# Altium schematic sheet HV_BUCK_V2.SchDoc (part 2 of 3)
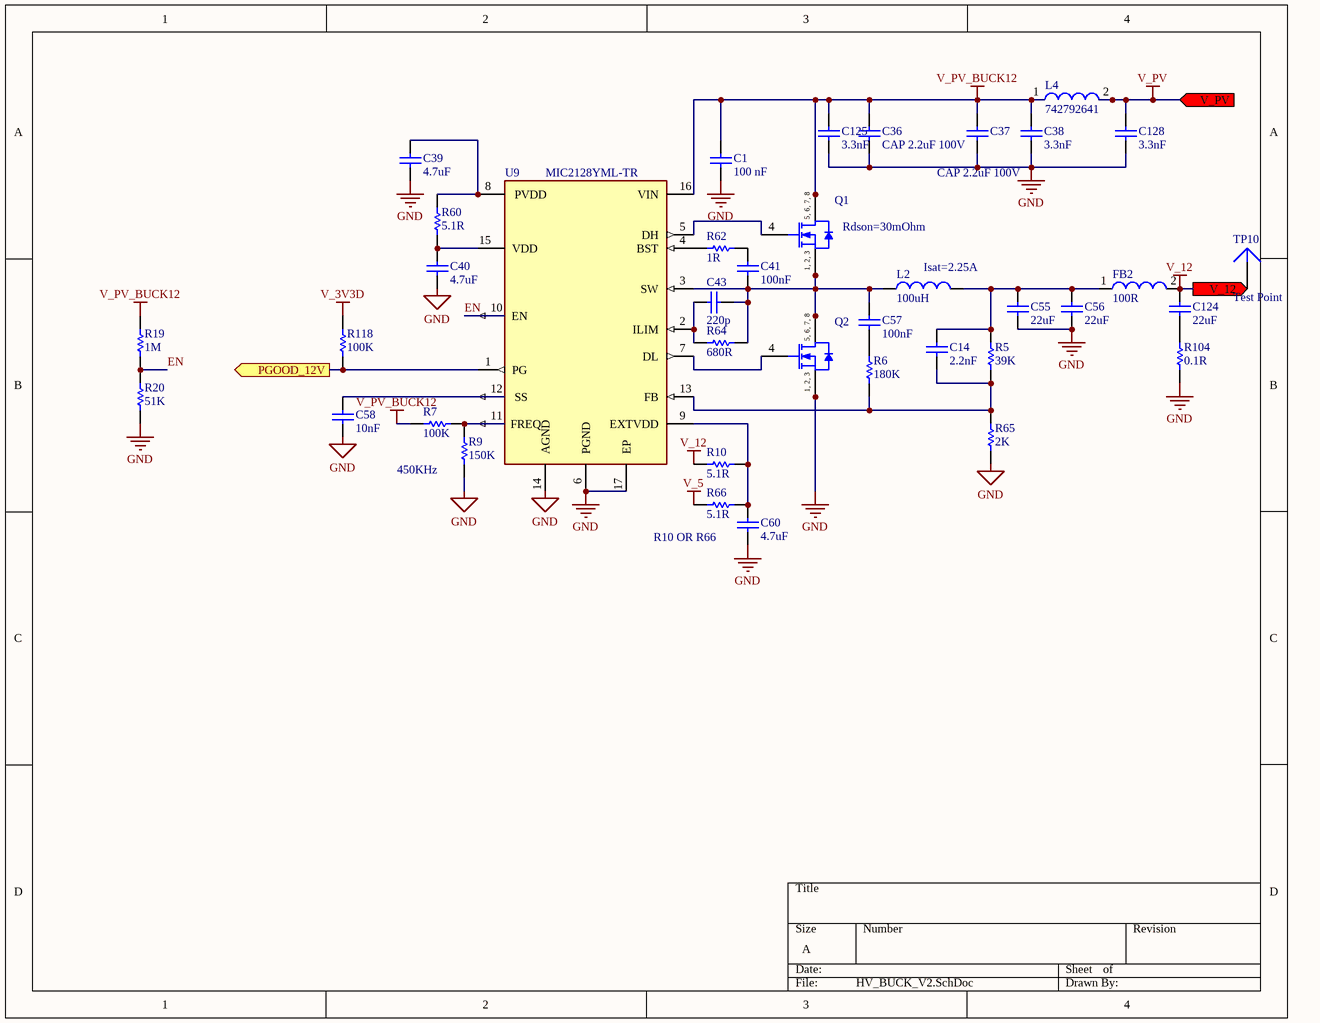
[diagram p1: HV_BUCK_V2.SchDoc]
## Library data of the parts
C1 = CAP: X7R 100nF ±10% 100V 0805 Multilayer Ceramic Capacitors MLCC - SMD/SMT ROHS; Manufacturer: AVX Interconnect / Elco; Part Number: 08051C104JAT2A; Manufacturer Part Number: CL21B104KCFNNNE; Tolerance: 5%; Dissipation Factor: 2.5%; Supplier 1: RSComponents; Supplier Part Number 1: 1356664; RoHS: Yes; Category: Ceramic Capacitors; Stock 1: 1; Pricing 1: 100=0.13700, 500=0.12500, 1000=0.11100 (USD); Mount: Surface Mount; Case/Package: 0805; Number of Pins: 2; Case Code (Metric): 2012; Case Code (Imperial): 0805; Min Operating Temperature: -55°C; Max Operating Temperature: 125°C; Package Quantity: 1; Capacitance: 100nF; Voltage Rating: 100V; Packaging: Tape and Reel; Voltage Rating (DC): 100V; Dielectric: X7R; Series: -; Termination: SMD/SMT; Construction: Flat; Voltage: 100V; Length: 2.01mm; Width: 0.049inch; Height: 1.4mm; Thickness: 0.055inch; Depth: 1.25mm; Radiation Hardening: No; RoHS Compliant: Yes; REACH SVHC: No SVHC; Lead Free: Lead Free; ComponentLink1URL: https://datasheet.ciiva.com/152/cx7r-152288.pdf?src-supplier=Digi-Key; ComponentLink1Description: https://datasheet.ciiva.com/152/cx7r-152288.pdf?src-supplier=Digi-Key; ComponentLink2URL: https://datasheet.ciiva.com/152/cx7r-152289.pdf?src-supplier=Digi-Key; ComponentLink2Description: https://datasheet.ciiva.com/152/cx7r-152289.pdf?src-supplier=Digi-Key; ComponentLink3URL: https://datasheet.ciiva.com/11504/cx7r-11504232.pdf?src-supplier=Avnet; ComponentLink3Description: https://datasheet.ciiva.com/11504/cx7r-11504232.pdf?src-supplier=Avnet; ComponentLink4URL: https://datasheet.ciiva.com/16326/cx7r-16326744.pdf?src-supplier=Future+Electronics; ComponentLink4Description: https://datasheet.ciiva.com/16326/cx7r-16326744.pdf?src-supplier=Future+Electronics; ComponentLink5URL: https://datasheet.ciiva.com/22676/1679506-22676600.pdf?src-supplier=Element14; ComponentLink5Description: https://datasheet.ciiva.com/22676/1679506-22676600.pdf?src-supplier=Element14; ComponentLink6URL: https://datasheet.ciiva.com/5427/cx7r-218113-5427354.pdf?src-supplier=Mouser; ComponentLink6Description: https://datasheet.ciiva.com/5427/cx7r-218113-5427354.pdf?src-supplier=Mouser; ComponentLink7URL: https://datasheet.ciiva.com/16625/cx7r-16625228.pdf?src-supplier=Avnet+Europe; ComponentLink7Description: https://datasheet.ciiva.com/16625/cx7r-16625228.pdf?src-supplier=Avnet+Europe; ComponentLink8URL: https://datasheet.ciiva.com/152/cx7r-152287.pdf?src-supplier=Digi-Key; ComponentLink8Description: https://datasheet.ciiva.com/152/cx7r-152287.pdf?src-supplier=Digi-Key; ComponentLink9URL: https://datasheet.ciiva.com/28613/1679506-28613087.pdf?src-supplier=Element14; ComponentLink9Description: https://datasheet.ciiva.com/28613/1679506-28613087.pdf?src-supplier=Element14; JLCPCB Part #: C28233; Parameter 1: *
C14 = CMP-2008-02907-1: X7R 2.2nF ±10% 50V 0402 Multilayer Ceramic Capacitors MLCC - SMD/SMT ROHS; Manufacturer: AVX Interconnect / Elco; Part Number: 04025C222JAT2A; Tolerance: 5%; Insulation Resistance: 100GR; Supplier 1: Digi-Key; Supplier Part Number 1: 478-5131-1-ND; Manufacturer Part Number: 04025C222JAT2A; RoHS: Yes; Category: Ceramic Capacitors; Stock 1: 9857; Pricing 1: 1=0.38000, 10=0.26200, 50=0.17480, 100=0.14860, 500=0.10488, 1000=0.09177, 2500=0.08740, 5000=0.08084 (USD); Mount: Surface Mount,PCB; Case/Package: 0402; Case Code (Metric): 1005; Case Code (Imperial): 0402; Dielectric Material: Ceramic; Contact Plating: Tin,Matte; Min Operating Temperature: -55°C; Max Operating Temperature: 125°C; Packaging: Tape and Reel; Capacitance: 2.2nF; Voltage Rating: 50V; Dielectric: X7R; Package Quantity: 1; Voltage Rating (DC): 50V; Termination: SMD/SMT; Voltage: 50V; Dissipation Factor: 10%; Length: 1mm; Width: 0.02inch; Height: 0.56mm; Thickness: 0.022inch; Depth: 0.5mm; Radiation Hardening: No; RoHS Compliant: Yes; REACH SVHC: No SVHC; Lead Free: Lead Free; ComponentLink1URL: https://datasheet.ciiva.com/1123/1679506-1123714.pdf?src-supplier=Element14; ComponentLink1Description: https://datasheet.ciiva.com/1123/1679506-1123714.pdf?src-supplier=Element14; ComponentLink2URL: https://datasheet.ciiva.com/152/cx7r-152323.pdf?src-supplier=Digi-Key; ComponentLink2Description: https://datasheet.ciiva.com/152/cx7r-152323.pdf?src-supplier=Digi-Key; ComponentLink3URL: https://datasheet.ciiva.com/1123/1679506-1123715.pdf?src-supplier=Element14; ComponentLink3Description: https://datasheet.ciiva.com/1123/1679506-1123715.pdf?src-supplier=Element14; ComponentLink4URL: https://datasheet.ciiva.com/152/cx7r-152324.pdf?src-supplier=Digi-Key; ComponentLink4Description: https://datasheet.ciiva.com/152/cx7r-152324.pdf?src-supplier=Digi-Key; ComponentLink5URL: https://datasheet.ciiva.com/152/cx7r-152325.pdf?src-supplier=Digi-Key; ComponentLink5Description: https://datasheet.ciiva.com/152/cx7r-152325.pdf?src-supplier=Digi-Key; ComponentLink6URL: https://datasheet.ciiva.com/7709/1679506-7709551.pdf?src-supplier=Element14; ComponentLink6Description: https://datasheet.ciiva.com/7709/1679506-7709551.pdf?src-supplier=Element14; Parameter 1: *; JLCPCB Part #: C1531
C36 C37 = CMP-1038-02104-1: CAP 2.2uF 100V ±10% 1210 (3225 Metric) Thickness 2.8mm SMD; Case-Metric: 3225; Tolerance: Â±10%; Case-EIA: 1210; Rated Voltage: 100 V; Value: 2.2uF; Technology: SMT; Max Thickness: 2.8 mm; Parameter 1: *; JLCPCB Part #: *
C38 C125 C128 = CMP-2006-04093-1: Part Number: 06031C332KAT2A; Manufacturer: AVX Interconnect / Elco; Dielectric Material: Ceramic; Tolerance: 10%; Voltage Rating: 100V; Dielectric: X7R; Dissipation Factor: 2.5%; Insulation Resistance: 100GR; Supplier 1: Digi-Key; Supplier Part Number 1: 478-1202-1-ND; Manufacturer Part Number: 06031C332KAT2A; RoHS: Yes; Category: Ceramic Capacitors; Stock 1: 8115; Pricing 1: 1=0.12000, 10=0.08500, 50=0.04840, 100=0.04000, 500=0.02806, 1000=0.02323 (USD); Mount: Surface Mount,PCB; Case/Package: 0603; Number of Pins: 2; Case Code (Metric): 1608; Case Code (Imperial): 0603; Contact Plating: Tin,Matte; Min Operating Temperature: -55°C; Max Operating Temperature: 125°C; Capacitance: 3.3nF; Packaging: Tape and Reel; Voltage Rating (DC): 100V; Series: -; Package Quantity: 1; Termination: SMD/SMT; Construction: Flat; Voltage: 100V; Length: 1.6mm; Width: 0.032inch; Height: 0.9mm; Thickness: 0.035inch; Depth: 0.81mm; Radiation Hardening: No; RoHS Compliant: Yes; Lead Free: Lead Free; REACH SVHC: No SVHC; ComponentLink1URL: https://datasheet.ciiva.com/151/cx7r-151090.pdf?src-supplier=Digi-Key; ComponentLink1Description: https://datasheet.ciiva.com/151/cx7r-151090.pdf?src-supplier=Digi-Key; ComponentLink2URL: https://datasheet.ciiva.com/151/cx7r-151091.pdf?src-supplier=Digi-Key; ComponentLink2Description: https://datasheet.ciiva.com/151/cx7r-151091.pdf?src-supplier=Digi-Key; ComponentLink3URL: https://datasheet.ciiva.com/151/cx7r-151092.pdf?src-supplier=Digi-Key; ComponentLink3Description: https://datasheet.ciiva.com/151/cx7r-151092.pdf?src-supplier=Digi-Key; ComponentLink4URL: https://datasheet.ciiva.com/7855/84526-7855208.pdf?src-supplier=Element14; ComponentLink4Description: https://datasheet.ciiva.com/7855/84526-7855208.pdf?src-supplier=Element14; ComponentLink5URL: https://datasheet.ciiva.com/7855/84526-7855209.pdf?src-supplier=Element14; ComponentLink5Description: https://datasheet.ciiva.com/7855/84526-7855209.pdf?src-supplier=Element14; ComponentLink6URL: https://datasheet.ciiva.com/14591/70001075-14591801.pdf?src-supplier=Allied+Electronics; ComponentLink6Description: https://datasheet.ciiva.com/14591/70001075-14591801.pdf?src-supplier=Allied+Electronics; ComponentLink7URL: https://datasheet.ciiva.com/16327/cx7r-16327243.pdf?src-supplier=Future+Electronics; ComponentLink7Description: https://datasheet.ciiva.com/16327/cx7r-16327243.pdf?src-supplier=Future+Electronics; ComponentLink8URL: https://datasheet.ciiva.com/2987/cx7r-2987741.pdf?src-supplier=Avnet; ComponentLink8Description: https://datasheet.ciiva.com/2987/cx7r-2987741.pdf?src-supplier=Avnet; ComponentLink9URL: https://datasheet.ciiva.com/5414/cx7r-218113-5414158.pdf?src-supplier=Mouser; ComponentLink9Description: https://datasheet.ciiva.com/5414/cx7r-218113-5414158.pdf?src-supplier=Mouser; Parameter 1: *; JLCPCB Part #: *
C39 C40 = CAP: X5R 25V ±10% 4.7uF 0805 Multilayer Ceramic Capacitors MLCC - SMD/SMT ROHS; Manufacturer: Murata; Part Number: GRM21BR71H105KA12L; Capacitance: 1uF; Voltage Rating: 50V; Dielectric: X7R; Supplier 1: Newark; Supplier Part Number 1: 24R6342; Manufacturer Part Number: GRM21BR71H105KA12L; RoHS: Yes; Category: Ceramic Capacitors; Mount: Surface Mount; Case/Package: 0805; Number of Pins: 2; Case Code (Metric): 2012; Case Code (Imperial): 0805; Material: Ceramic; Min Operating Temperature: -55°C; Max Operating Temperature: 125°C; Tolerance: 10%; Packaging: Tape and Reel; Package Quantity: 1; Voltage Rating (DC): 50V; Termination: SMD/SMT; Series: GRM; Voltage: 50V; Construction: Flat; Length: 2mm; Width: 0.049inch; Height: 1.25mm; Thickness: 0.053inch; Depth: 1.25mm; Radiation Hardening: No; REACH SVHC: No SVHC; RoHS Compliant: Yes; Lead Free: Lead Free; ComponentLink1URL: https://datasheet.ciiva.com/28659/1684872-28659460.pdf?src-supplier=Element14; ComponentLink1Description: https://datasheet.ciiva.com/28659/1684872-28659460.pdf?src-supplier=Element14; ComponentLink2URL: https://datasheet.ciiva.com/22774/1747475-22774409.pdf?src-supplier=Farnell; ComponentLink2Description: https://datasheet.ciiva.com/22774/1747475-22774409.pdf?src-supplier=Farnell; ComponentLink3URL: https://datasheet.ciiva.com/139/grm21br71h105ka12-139467.pdf?src-supplier=Digi-Key; ComponentLink3Description: https://datasheet.ciiva.com/139/grm21br71h105ka12-139467.pdf?src-supplier=Digi-Key; ComponentLink4URL: https://datasheet.ciiva.com/3777/8166grm21br71h105ka1223-3777308.pdf?src-supplier=Arrow+Electronics; ComponentLink4Description: https://datasheet.ciiva.com/3777/8166grm21br71h105ka1223-3777308.pdf?src-supplier=Arrow+Electronics; ComponentLink5URL: https://datasheet.ciiva.com/29202/450841-da-01-de-vs-chip-kond-0805-1-0-uf-10pr-50-0v-x7r-29202833.pdf?src-supplier=Conrad; ComponentLink5Description: https://datasheet.ciiva.com/29202/450841-da-01-de-vs-chip-kond-0805-1-0-uf-10pr-50-0v-x7r-29202833.pdf?src-supplier=Conrad; ComponentLink6URL: https://datasheet.ciiva.com/29199/454791-da-01-en-vs-kondensator-0805-29199539.pdf?src-supplier=Conrad; ComponentLink6Description: https://datasheet.ciiva.com/29199/454791-da-01-en-vs-kondensator-0805-29199539.pdf?src-supplier=Conrad; ComponentLink7URL: https://datasheet.ciiva.com/16199/product-16199127.pdf?src-supplier=Future+Electronics; ComponentLink7Description: https://datasheet.ciiva.com/16199/product-16199127.pdf?src-supplier=Future+Electronics; ComponentLink8URL: https://datasheet.ciiva.com/22774/608985-22774411.pdf?src-supplier=Farnell; ComponentLink8Description: https://datasheet.ciiva.com/22774/608985-22774411.pdf?src-supplier=Farnell; ComponentLink9URL: https://datasheet.ciiva.com/22774/608985-22774412.pdf?src-supplier=Farnell; ComponentLink9Description: https://datasheet.ciiva.com/22774/608985-22774412.pdf?src-supplier=Farnell; Parameter 1: *; JLCPCB Part #: C1779
C41 = CMP-2008-02800-1: X7R 100nF ±10% 16V 0402 Multilayer Ceramic Capacitors MLCC - SMD/SMT ROHS; Manufacturer: AVX Interconnect / Elco; Part Number: 0402YC104KAT2A; Supplier 1: Digi-Key; Supplier Part Number 1: 478-7888-1-ND; Manufacturer Part Number: 0402YC104KAT2A; RoHS: Yes; Category: Ceramic Capacitors; Stock 1: 72315; Pricing 1: 1=0.10000, 10=0.01600, 50=0.00860, 100=0.00700, 500=0.00500, 1000=0.00393, 2500=0.00358, 5000=0.00329 (USD); Mount: Surface Mount,PCB; Case/Package: 0402; Case Code (Metric): 1005; Case Code (Imperial): 0402; Dielectric Material: Ceramic; Contact Plating: Tin,Matte; Min Operating Temperature: -55°C; Max Operating Temperature: 125°C; Tolerance: 10%; Packaging: Tape and Reel; Capacitance: 100nF; Voltage Rating: 16V; Voltage Rating (DC): 16V; Dielectric: X7R; Voltage: 16V; Package Quantity: 1; Termination: SMD/SMT; Series: -; Construction: Flat; Length: 1mm; Width: 0.02inch; Height: 0.56mm; Thickness: 0.022inch; Depth: 0.5mm; Radiation Hardening: No; REACH SVHC: Unknown; RoHS Compliant: Yes; Lead Free: Lead Free; ComponentLink1URL: https://datasheet.ciiva.com/1123/1679506-1123956.pdf?src-supplier=Element14; ComponentLink1Description: https://datasheet.ciiva.com/1123/1679506-1123956.pdf?src-supplier=Element14; ComponentLink2URL: https://datasheet.ciiva.com/7614/cx7r-7614662.pdf?src-supplier=Digi-Key; ComponentLink2Description: https://datasheet.ciiva.com/7614/cx7r-7614662.pdf?src-supplier=Digi-Key; ComponentLink3URL: https://datasheet.ciiva.com/22693/1679506-22693578.pdf?src-supplier=Element14; ComponentLink3Description: https://datasheet.ciiva.com/22693/1679506-22693578.pdf?src-supplier=Element14; ComponentLink4URL: https://datasheet.ciiva.com/16623/cx7r-16623291.pdf?src-supplier=Avnet+Europe; ComponentLink4Description: https://datasheet.ciiva.com/16623/cx7r-16623291.pdf?src-supplier=Avnet+Europe; ComponentLink5URL: https://datasheet.ciiva.com/2987/cx7r-2987708.pdf?src-supplier=Avnet; ComponentLink5Description: https://datasheet.ciiva.com/2987/cx7r-2987708.pdf?src-supplier=Avnet; ComponentLink6URL: https://datasheet.ciiva.com/6265/cx7r-6265276.pdf?src-supplier=Digi-Key; ComponentLink6Description: https://datasheet.ciiva.com/6265/cx7r-6265276.pdf?src-supplier=Digi-Key; ComponentLink7URL: https://datasheet.ciiva.com/28613/1679506-28613260.pdf?src-supplier=Element14; ComponentLink7Description: https://datasheet.ciiva.com/28613/1679506-28613260.pdf?src-supplier=Element14; ComponentLink8URL: https://datasheet.ciiva.com/5411/cx7r-218113-5411197.pdf?src-supplier=Mouser; ComponentLink8Description: https://datasheet.ciiva.com/5411/cx7r-218113-5411197.pdf?src-supplier=Mouser; ComponentLink9URL: https://datasheet.ciiva.com/7709/1679506-7709566.pdf?src-supplier=Element14; ComponentLink9Description: https://datasheet.ciiva.com/7709/1679506-7709566.pdf?src-supplier=Element14; Parameter 1: *; JLCPCB Part #: C1525
C43 = CAP: X7R 220pF ±10% 50V 0402 Multilayer Ceramic Capacitors MLCC - SMD/SMT ROHS; Manufacturer: AVX Interconnect / Elco; Part Number: 04025C222JAT2A; Tolerance: 5%; Insulation Resistance: 100GR; Supplier 1: Digi-Key; Supplier Part Number 1: 478-5131-1-ND; Manufacturer Part Number: 04025C222JAT2A; RoHS: Yes; Category: Ceramic Capacitors; Stock 1: 9857; Pricing 1: 1=0.38000, 10=0.26200, 50=0.17480, 100=0.14860, 500=0.10488, 1000=0.09177, 2500=0.08740, 5000=0.08084 (USD); Mount: Surface Mount,PCB; Case/Package: 0402; Case Code (Metric): 1005; Case Code (Imperial): 0402; Dielectric Material: Ceramic; Contact Plating: Tin,Matte; Min Operating Temperature: -55°C; Max Operating Temperature: 125°C; Packaging: Tape and Reel; Capacitance: 220pF; Voltage Rating: 50V; Dielectric: X7R; Package Quantity: 1; Voltage Rating (DC): 50V; Termination: SMD/SMT; Voltage: 50V; Dissipation Factor: 10%; Length: 1mm; Width: 0.02inch; Height: 0.56mm; Thickness: 0.022inch; Depth: 0.5mm; Radiation Hardening: No; RoHS Compliant: Yes; REACH SVHC: No SVHC; Lead Free: Lead Free; ComponentLink1URL: https://datasheet.ciiva.com/1123/1679506-1123714.pdf?src-supplier=Element14; ComponentLink1Description: https://datasheet.ciiva.com/1123/1679506-1123714.pdf?src-supplier=Element14; ComponentLink2URL: https://datasheet.ciiva.com/152/cx7r-152323.pdf?src-supplier=Digi-Key; ComponentLink2Description: https://datasheet.ciiva.com/152/cx7r-152323.pdf?src-supplier=Digi-Key; ComponentLink3URL: https://datasheet.ciiva.com/1123/1679506-1123715.pdf?src-supplier=Element14; ComponentLink3Description: https://datasheet.ciiva.com/1123/1679506-1123715.pdf?src-supplier=Element14; ComponentLink4URL: https://datasheet.ciiva.com/152/cx7r-152324.pdf?src-supplier=Digi-Key; ComponentLink4Description: https://datasheet.ciiva.com/152/cx7r-152324.pdf?src-supplier=Digi-Key; ComponentLink5URL: https://datasheet.ciiva.com/152/cx7r-152325.pdf?src-supplier=Digi-Key; ComponentLink5Description: https://datasheet.ciiva.com/152/cx7r-152325.pdf?src-supplier=Digi-Key; ComponentLink6URL: https://datasheet.ciiva.com/7709/1679506-7709551.pdf?src-supplier=Element14; ComponentLink6Description: https://datasheet.ciiva.com/7709/1679506-7709551.pdf?src-supplier=Element14; Parameter 1: *; JLCPCB Part #: C1530
C55 C56 C124 = CMP-2000-05478-1: Ceramic Capacitor, 25 V, 22 uF, +/-10%, -55 to 85 degC, 2-Pin SMD (1210), RoHS, Tape and Reel; Temperature Coefficient / Code: +/-15%; Case Height: 2.79mm; Brand: AVX; Case Width: 2.5mm; Tolerance: 10%; Voltage Rating: 25V; Dielectric: X5R; Case Length: 3.2mm; Type: StandardX5RMLCCs; Case Code - in: 1210; Packaging: Reel; Minimum Operating Temperature: -55C; Package Reference: 1210; Product Category: MultilayerCeramicCapacitorsMLCC-SMD/SMT; Package / Case: 1210(3225metric); Dimensions: 2.5mmWx3.2mmLx2.79mmH; Capacitance: 22uF; RoHS: Details; Manufacturer: AVX; Case Code - mm: 3225; Maximum Operating Temperature: +85C; Operating Temperature Range: -55Cto+85C; Mounting Technology: SurfaceMount; Product: GeneralTypeMLCCs; Manufacturer URL: http://www.avx.com/; Termination Style: SMD/SMT; Package Description: 2-Pin Surface Mount Device, Body 3.2 x 2.5 mm; Datasheet URL: http://datasheets.avx.com/cx5r.pdf; Datasheet Version: 05/2016; Voltage Rating DC: 25V; Factory Pack Quantity: 1000; Parameter 1: *; JLCPCB Part #: *
C57 = CAP: X7R 100nF ±10% 50V 0603 Multilayer Ceramic Capacitors MLCC - SMD/SMT ROHS; Part Number: GCM188R72A104KA64D; Manufacturer: Murata; Manufacturer Part Number: CC0603KRX7R9BB104; Voltage Rating: 100V; Supplier 1: Arrow Electronics; Supplier Part Number 1: GCM188R72A104KA64D; RoHS: Yes; Category: Ceramic Capacitors; Mount: Surface Mount; Case/Package: 0603; Case Code (Imperial): 0603; Case Code (Metric): 1608; Min Operating Temperature: -55°C; Max Operating Temperature: 125°C; Tolerance: 10%; Packaging: Tape and Reel; Capacitance: 100nF; Dielectric: X7R; Termination: SMD/SMT; Voltage Rating (DC): 100V; Length: 1.6mm; Height: 0.8mm; Depth: 0.8mm; Radiation Hardening: No; ComponentLink1URL: https://datasheet.ciiva.com/17451/product-17451047.pdf?src-supplier=Avnet+Europe; ComponentLink1Description: https://datasheet.ciiva.com/17451/product-17451047.pdf?src-supplier=Avnet+Europe; ComponentLink2URL: https://datasheet.ciiva.com/26889/getdatasheetpartid-387765-26889164.pdf?src-supplier=Verical; ComponentLink2Description: https://datasheet.ciiva.com/26889/getdatasheetpartid-387765-26889164.pdf?src-supplier=Verical; Parameter 1: *; JLCPCB Part #: C14663
C58 = CMP-2008-02925-1: X7R ±10% 50V 10nF 0603 Multilayer Ceramic Capacitors MLCC - SMD/SMT ROHS; Manufacturer: AVX Interconnect / Elco; Part Number: 04023C103JAT2A; Tolerance: 5%; Voltage Rating: 25V; Supplier 1: Digi-Key; Supplier Part Number 1: 478-7867-1-ND; Manufacturer Part Number: 04023C103JAT2A; RoHS: Yes; Category: Ceramic Capacitors; Stock 1: 9159; Pricing 1: 1=0.35000, 10=0.24300, 50=0.16980, 100=0.14560, 500=0.10920, 1000=0.09221, 2500=0.08735, 5000=0.08250 (USD); Mount: Surface Mount; Case/Package: 0402; Number of Pins: 2; Case Code (Imperial): 0402; Case Code (Metric): 1005; Min Operating Temperature: -55°C; Max Operating Temperature: 125°C; Packaging: Tape and Reel; Capacitance: 10nF; Package Quantity: 1; Voltage Rating (DC): 25V; Dielectric: X7R; Termination: SMD/SMT; Series: -; Construction: Flat; Length: 1mm; Width: 0.5mm; Thickness: 0.022inch; Depth: 0.5mm; Radiation Hardening: No; RoHS Compliant: Yes; Lead Free: Lead Free; ComponentLink1URL: https://datasheet.ciiva.com/11499/cx7r-11499815.pdf?src-supplier=Avnet; ComponentLink1Description: https://datasheet.ciiva.com/11499/cx7r-11499815.pdf?src-supplier=Avnet; ComponentLink2URL: https://datasheet.ciiva.com/5424/cx7r-218113-5424201.pdf?src-supplier=Mouser; ComponentLink2Description: https://datasheet.ciiva.com/5424/cx7r-218113-5424201.pdf?src-supplier=Mouser; ComponentLink3URL: https://datasheet.ciiva.com/7614/cx7r-7614730.pdf?src-supplier=Digi-Key; ComponentLink3Description: https://datasheet.ciiva.com/7614/cx7r-7614730.pdf?src-supplier=Digi-Key; ComponentLink4URL: https://datasheet.ciiva.com/208/cx7r-208205.pdf?src-supplier=Digi-Key; ComponentLink4Description: https://datasheet.ciiva.com/208/cx7r-208205.pdf?src-supplier=Digi-Key; ComponentLink5URL: https://datasheet.ciiva.com/14906/cx7r-14906237.pdf?src-supplier=Digi-Key; ComponentLink5Description: https://datasheet.ciiva.com/14906/cx7r-14906237.pdf?src-supplier=Digi-Key; ComponentLink6URL: https://datasheet.ciiva.com/16397/cx7r-16397645.pdf?src-supplier=Future+Electronics; ComponentLink6Description: https://datasheet.ciiva.com/16397/cx7r-16397645.pdf?src-supplier=Future+Electronics; ComponentLink7URL: https://datasheet.ciiva.com/14906/cx7r-14906238.pdf?src-supplier=Digi-Key; ComponentLink7Description: https://datasheet.ciiva.com/14906/cx7r-14906238.pdf?src-supplier=Digi-Key; Parameter 1: *; JLCPCB Part #: C57112
C60 = CMP-1036-04761-2: X5R 25V ±10% 4.7uF 0805 Multilayer Ceramic Capacitors MLCC - SMD/SMT ROHS; Manufacturer: Murata; Part Number: GRM21BR71H105KA12L; Capacitance: 1uF; Voltage Rating: 50V; Dielectric: X7R; Supplier 1: Newark; Supplier Part Number 1: 24R6342; Manufacturer Part Number: GRM21BR71H105KA12L; RoHS: Yes; Category: Ceramic Capacitors; Mount: Surface Mount; Case/Package: 0805; Number of Pins: 2; Case Code (Metric): 2012; Case Code (Imperial): 0805; Material: Ceramic; Min Operating Temperature: -55°C; Max Operating Temperature: 125°C; Tolerance: 10%; Packaging: Tape and Reel; Package Quantity: 1; Voltage Rating (DC): 50V; Termination: SMD/SMT; Series: GRM; Voltage: 50V; Construction: Flat; Length: 2mm; Width: 0.049inch; Height: 1.25mm; Thickness: 0.053inch; Depth: 1.25mm; Radiation Hardening: No; REACH SVHC: No SVHC; RoHS Compliant: Yes; Lead Free: Lead Free; ComponentLink1URL: https://datasheet.ciiva.com/28659/1684872-28659460.pdf?src-supplier=Element14; ComponentLink1Description: https://datasheet.ciiva.com/28659/1684872-28659460.pdf?src-supplier=Element14; ComponentLink2URL: https://datasheet.ciiva.com/22774/1747475-22774409.pdf?src-supplier=Farnell; ComponentLink2Description: https://datasheet.ciiva.com/22774/1747475-22774409.pdf?src-supplier=Farnell; ComponentLink3URL: https://datasheet.ciiva.com/139/grm21br71h105ka12-139467.pdf?src-supplier=Digi-Key; ComponentLink3Description: https://datasheet.ciiva.com/139/grm21br71h105ka12-139467.pdf?src-supplier=Digi-Key; ComponentLink4URL: https://datasheet.ciiva.com/3777/8166grm21br71h105ka1223-3777308.pdf?src-supplier=Arrow+Electronics; ComponentLink4Description: https://datasheet.ciiva.com/3777/8166grm21br71h105ka1223-3777308.pdf?src-supplier=Arrow+Electronics; ComponentLink5URL: https://datasheet.ciiva.com/29202/450841-da-01-de-vs-chip-kond-0805-1-0-uf-10pr-50-0v-x7r-29202833.pdf?src-supplier=Conrad; ComponentLink5Description: https://datasheet.ciiva.com/29202/450841-da-01-de-vs-chip-kond-0805-1-0-uf-10pr-50-0v-x7r-29202833.pdf?src-supplier=Conrad; ComponentLink6URL: https://datasheet.ciiva.com/29199/454791-da-01-en-vs-kondensator-0805-29199539.pdf?src-supplier=Conrad; ComponentLink6Description: https://datasheet.ciiva.com/29199/454791-da-01-en-vs-kondensator-0805-29199539.pdf?src-supplier=Conrad; ComponentLink7URL: https://datasheet.ciiva.com/16199/product-16199127.pdf?src-supplier=Future+Electronics; ComponentLink7Description: https://datasheet.ciiva.com/16199/product-16199127.pdf?src-supplier=Future+Electronics; ComponentLink8URL: https://datasheet.ciiva.com/22774/608985-22774411.pdf?src-supplier=Farnell; ComponentLink8Description: https://datasheet.ciiva.com/22774/608985-22774411.pdf?src-supplier=Farnell; ComponentLink9URL: https://datasheet.ciiva.com/22774/608985-22774412.pdf?src-supplier=Farnell; ComponentLink9Description: https://datasheet.ciiva.com/22774/608985-22774412.pdf?src-supplier=Farnell; Parameter 1: *; JLCPCB Part #: C1779
FB2 = CMP-0220-00115-1: SMD EMI Suppression Ferrite Bead WE-CBF, Z = 1500 Ohm; DatasheetVersion: Dec-2005; ComponentLink1URL: http://www.we-online.com; PackageVersion: 2009; PackageDescription: Chip Inductor, 2-Leads, Body 1.6 x 0.8 mm; ComponentLink2URL: http://www.we-online.de/katalog/media/pdf/742792691.pdf; ComponentLink1Description: Manufacturer Link; ComponentLink2Description: Datasheet; Impedance: 1500 Ohm; PackageReference: SMD-0603; Parameter 1: *; JLCPCB Part #: *
L2 = CMP-2000-06447-1: Low Profile, High Current IHLP(R) Inductor, 100 uH, +/- 20%, 2.5 A, -55 to 125 degC, 2-Pin SMD, RoHS, Tape and Reel; Manufacturer: Vishay; Manufacturer Part Number: IHLP4040DZER101M11; Qualification: AEC-Q200; Test Frequency: 100kHz; Maximum DC Resistance: 270mOhms; Type: LowProfileHighCurrentIHLPInductor; Unit Weight: 0.070548oz; Shielding: Shielded; Brand: Vishay/Dale; Maximum DC Current: 2.25A; Core Material: Ferrite,Metal,Composite; Current Rating: 2.5A; Self Resonant Frequency: 1MHz; DC Resistance (DCR): 270mR; Current: 1.3A; Termination Style: SMD/SMT; Mounting Style: SMD/SMT; Tolerance: 20%; Factory Pack Quantity: 500; Product Category: FixedInductors; Mounting Technology: SurfaceMount; Manufacturer URL: http://www.vishay.com/; Operating Temperature Range: -55Cto+125C; Datasheet Version: 08/2015; Product: PowerInductors; Packaging: Reel; Length: 10.3mm; Inductance: 100uH; Package Description: 2-Pin Surface Mount Device, Body 10.3 x 10.3 mm; Height: 4mm; Width: 10.3mm; Series: IHLP-4040DZ-11; RoHS: True; Package Reference: IHLP4040DZER101M11; Tradename: IHLP; Datasheet URL: http://www.vishay.com/docs/34192/lp40dz11.pdf; Package / Case: 4040; Supplier 1: Avnet; Supplier Part Number 1: IHLP4040DZER101M11; Category: Fixed Inductors; Stock 1: 10000; Pricing 1: 500=0.59680, 1000=0.58220, 2000=0.57400, 3000=0.54128, 4000=0.52934, 5000=0.51740, 50000=0.48006 (USD); Mount: Surface Mount,Through Hole; Case/Package: 4040; Number of Pins: 2; Contact Plating: Tin; Weight: 0.070548oz; Min Operating Temperature: -55°C; Max Operating Temperature: 125°C; Saturation Current: 2.25A; Package Quantity: 1; Inductance Tolerance: 20%; Max DC Current: 2.25A; Termination: SMD/SMT; RMS Current (Irms): 2.5A; Height - Seated (Max): 0.157inch; Depth: 10.3mm; Radiation Hardening: No; REACH SVHC: Unknown; Military Standard: Not; Lead Free: Lead Free; ComponentLink1URL: https://datasheet.ciiva.com/11798/0900766b8102c938-11798178.pdf?src-supplier=RSComponents; ComponentLink1Description: https://datasheet.ciiva.com/11798/0900766b8102c938-11798178.pdf?src-supplier=RSComponents; ComponentLink2URL: https://datasheet.ciiva.com/8494/lp40dz11-8494200.pdf?src-supplier=Avnet; ComponentLink2Description: https://datasheet.ciiva.com/8494/lp40dz11-8494200.pdf?src-supplier=Avnet; ComponentLink3URL: https://datasheet.ciiva.com/8017/27487-8017341.pdf?src-supplier=Element14; ComponentLink3Description: https://datasheet.ciiva.com/8017/27487-8017341.pdf?src-supplier=Element14; ComponentLink4URL: https://datasheet.ciiva.com/8017/27487-8017342.pdf?src-supplier=Element14; ComponentLink4Description: https://datasheet.ciiva.com/8017/27487-8017342.pdf?src-supplier=Element14; Parameter 1: *; JLCPCB Part #: *
L4 = PAS-IND-INDUCTOR-2: SMD EMI Suppression Ferrite Bead WE-CBF, Z = 300 Ohm; Manufacturer: Wurth Electronics; Impedance: 300 Ohm; Current Rating: 2A; Number of Lines: 1; DC Resistance (DCR): 150mR; Test Frequency: 100MHz; Tolerance: 25%; Inductance: 18nH; PackageReference: SMD-0603; PackageVersion: 2009; ComponentLink2Description: Datasheet; ComponentLink2URL: http://www.we-online.de/katalog/media/pdf/742792641.pdf; ComponentLink1Description: Manufacturer Link; ComponentLink1URL: http://www.we-online.com; DatasheetVersion: Dec-2005; PackageDescription: Chip Inductor, 2-Leads, Body 1.6 x 0.8 mm; Supplier 1: Digi-Key; Supplier Part Number 1: 732-1592-1-ND; Manufacturer Part Number: 742792641; RoHS: Yes; Category: Ferrite Beads and Chips; Stock 1: 74138; Pricing 1: 1=0.17000, 50=0.16800, 100=0.15500, 500=0.14800, 1000=0.14100, 2000=0.13400 (USD); Mount: Surface Mount; Case/Package: SMD/SMT; Weight: 0.000141oz; Core Material: Ferrite; Case Code (Metric): 1608; Case Code (Imperial): 0603; Material: Ferrite; Min Operating Temperature: -55°C; Max Operating Temperature: 125°C; Package Quantity: 1; Packaging: Tape and Reel; Max Current Rating: 2A; Max DC Current: 2A; Termination: SMD/SMT; Series: WE-CBF; Length: 1.6mm; Width: 0.8mm; Height: 0.8mm; Depth: 0.8mm; REACH SVHC: Unknown; Lead Free: Lead Free; RoHS Compliant: Yes; ComponentLink3URL: https://datasheet.ciiva.com/1013/742792641-1013888.pdf?src-supplier=Digi-Key; ComponentLink3Description: https://datasheet.ciiva.com/1013/742792641-1013888.pdf?src-supplier=Digi-Key; ComponentLink4URL: https://datasheet.ciiva.com/4940/742792641-72209-4940450.pdf?src-supplier=Mouser; ComponentLink4Description: https://datasheet.ciiva.com/4940/742792641-72209-4940450.pdf?src-supplier=Mouser; ComponentLink5URL: https://datasheet.ciiva.com/1466/1705830-1466501.pdf?src-supplier=Element14; ComponentLink5Description: https://datasheet.ciiva.com/1466/1705830-1466501.pdf?src-supplier=Element14; ComponentLink6URL: https://datasheet.ciiva.com/11800/0900766b80d2e072-11800409.pdf?src-supplier=RSComponents; ComponentLink6Description: https://datasheet.ciiva.com/11800/0900766b80d2e072-11800409.pdf?src-supplier=RSComponents; ComponentLink7URL: https://datasheet.ciiva.com/1013/742792641-1013889.pdf?src-supplier=Digi-Key; ComponentLink7Description: https://datasheet.ciiva.com/1013/742792641-1013889.pdf?src-supplier=Digi-Key; ComponentLink8URL: https://datasheet.ciiva.com/1466/1705830-1466502.pdf?src-supplier=Element14; ComponentLink8Description: https://datasheet.ciiva.com/1466/1705830-1466502.pdf?src-supplier=Element14; Parameter 1: *; JLCPCB Part #: *
Q1 Q2 = CMP-1091-00311-1: N-Channel OptiMOS 3 Power-Transistor, 80 V VDS, 23 A ID, -55 to 150 degC, PG-TSDSON-8-1, Reel, Green; Manufacturer: Infineon; IDpuls (max): 92Â A; Green: TRUE; VGS(th) (min): 2Â V; QG: 6.8Â nC; Ptot (max): 32Â W; RDS (on) (max): 34Â mOhm; RDS (on) (max) (@4.5V): 66Â mOhm; Rth: 3.9Â K/W; VGS(th) (max): 3.5Â V; RthJA (max): 60 K/W; Polarity: N; ID (max): 23Â A; VDS (max): 80Â V; PackageVersion: Rev. 02, 09/2008; PackageReference: PG-TSDSON-8-1; PackageDescription: 8-Pin Plastic (Green) Thin Dual Small Outline Non-Leaded Package, 3.3 x 3.3 mm Body, 0.65 mm Pitch; DatasheetVersion: Rev. 2.3; PartNumber: IAUZ20N08S5L300; Mounting Technology: Surface Mount; ComponentLink1Description: Manufacturer URL; ComponentLink2Description: Datasheet; ComponentLink3URL: http://www.infineon.com/dgdl/BSZ240N12NS3+Rev2.0.pdf?folderId=db3a304313b8b5a60113cee8763b02d7&fileId=db3a30432a40a650012a42f3057a0038; Packing: Reel; ComponentLink1URL: http://www.infineon.com/; RthJC (max): 3.9Â K/W; ComponentLink3Description: Package Specification; Halogen-free: TRUE; ComponentLink2URL: http://www.infineon.com/dgdl/BSZ340N08NS3G_rev2.3.pdf?folderId=db3a304313b8b5a60113cee8763b02d7&fileId=db3a30431ff9881501206626660b6c72; Parameter 1: *; JLCPCB Part #: *
R5 = CMP-2002-07052-1: ±1% 39kΩ 1/16W ±100ppm/℃ 0402 Chip Resistor - Surface Mount ROHS; Manufacturer: Yageo / Phycomp; Part Number: RC0402FR-0719K1L; Resistance: 19.1kR; Temperature Coefficient: 100ppm/°C; Power Rating: 62.5mW; Voltage Rating: 50V; Max Power Dissipation: 63mW; Supplier 1: Digi-Key; Supplier Part Number 1: 311-19.1KLRCT-ND; Manufacturer Part Number: RC0402FR-0719K1L; RoHS: Yes; Category: Chip SMD Resistors; Stock 1: 185582; Pricing 1: 1=0.10000, 10=0.01600, 100=0.00660, 1000=0.00299, 2500=0.00259, 5000=0.00214 (USD); Case/Package: 0402; Case Code (Imperial): 0402; Case Code (Metric): 1005; Contact Plating: Tin,Matte; Size Code: 0402; Min Operating Temperature: -55°C; Max Operating Temperature: 155°C; Packaging: Tape and Reel; Tolerance: 1%; Resistor Type: Thick Film; Termination: SMD/SMT; Voltage Rating (DC): 50V; Series: RC; Package Quantity: 1; Number of Terminations: 2; Features: Moisture Resistant; Construction: Rectangular; Length: 0.039inch; Width: 0.02inch; Height: 0.016inch; Depth: 0.5mm; RoHS Compliant: Yes; Lead Free: Lead Free; Military Standard: Not; ComponentLink1URL: https://datasheet.ciiva.com/17068/pyu-rc0402-51-rohs-l-6-r-17068405.pdf?src-supplier=Future+Electronics; ComponentLink1Description: https://datasheet.ciiva.com/17068/pyu-rc0402-51-rohs-l-6-r-17068405.pdf?src-supplier=Future+Electronics; ComponentLink2URL: https://datasheet.ciiva.com/16869/pyu-rc0402-51-rohs-l-6-16869416.pdf?src-supplier=Avnet+Europe; ComponentLink2Description: https://datasheet.ciiva.com/16869/pyu-rc0402-51-rohs-l-6-16869416.pdf?src-supplier=Avnet+Europe; ComponentLink3URL: https://datasheet.ciiva.com/2553/pyu-r-int-thick-7-2553197.pdf?src-supplier=Digi-Key; ComponentLink3Description: https://datasheet.ciiva.com/2553/pyu-r-int-thick-7-2553197.pdf?src-supplier=Digi-Key; ComponentLink4URL: https://datasheet.ciiva.com/2553/pyu-r-int-thick-7-2553198.pdf?src-supplier=Digi-Key; ComponentLink4Description: https://datasheet.ciiva.com/2553/pyu-r-int-thick-7-2553198.pdf?src-supplier=Digi-Key; ComponentLink5URL: https://datasheet.ciiva.com/28402/pyu-rc0402-51-rohs-l-6-28402894.pdf?src-supplier=Avnet+Europe; ComponentLink5Description: https://datasheet.ciiva.com/28402/pyu-rc0402-51-rohs-l-6-28402894.pdf?src-supplier=Avnet+Europe; ComponentLink6URL: https://datasheet.ciiva.com/2553/pyu-r-int-thick-7-2553199.pdf?src-supplier=Digi-Key; ComponentLink6Description: https://datasheet.ciiva.com/2553/pyu-r-int-thick-7-2553199.pdf?src-supplier=Digi-Key; Parameter 1: *; JLCPCB Part #: C25783
R6 = CMP-2000-00296-1: ±1% 180kΩ ±100ppm/℃ 0.1W 0603 Chip Resistor - Surface Mount ROHS; Part Number: ERJ3EKF1803V; Manufacturer: Panasonic; Manufacturer Part Number: ERJ-3EKF1803V; Resistance: 180kR; Power Rating: 100mW; Voltage Rating: 75V; Temperature Coefficient: 100ppm/°C; Supplier 1: Digi-Key; Supplier Part Number 1: P180KHCT-ND; RoHS: Yes; Category: Chip SMD Resistors; Stock 1: 113875; Pricing 1: 1=0.10000, 10=0.06100, 100=0.02460, 1000=0.01106, 2500=0.00960 (USD); Mount: Surface Mount; Case/Package: 0603; Case Code (Metric): 1608; Case Code (Imperial): 0603; Contact Plating: Tin; Weight: 7.1E-05oz; Min Operating Temperature: -55°C; Max Operating Temperature: 155°C; Tolerance: 1%; Packaging: Tape and Reel; Resistor Type: Thick Film; Series: ERJ; Package Quantity: 1; Number of Terminations: 2; Termination: SMD/SMT; Max Power Dissipation: 100mW; Voltage Rating (DC): 75V; Construction: Rectangular; Features: Automotive AEC-Q200; Resistance Tolerance: 1%; Length: 1.6mm; Width: 0.031inch; Height: 0.022inch; Depth: 0.8mm; Radiation Hardening: No; RoHS Compliant: Yes; Military Standard: Not; Lead Free: Lead Free; REACH SVHC: No SVHC; ComponentLink1URL: https://datasheet.ciiva.com/22739/426256-22739797.pdf?src-supplier=Element14; ComponentLink1Description: https://datasheet.ciiva.com/22739/426256-22739797.pdf?src-supplier=Element14; ComponentLink2URL: https://datasheet.ciiva.com/24162/aoa0000ce2-24162661.pdf?src-supplier=Mouser; ComponentLink2Description: https://datasheet.ciiva.com/24162/aoa0000ce2-24162661.pdf?src-supplier=Mouser; ComponentLink3URL: https://datasheet.ciiva.com/30137/aoa0000ce2-30137813.pdf?src-supplier=Onlinecomponents.com; ComponentLink3Description: https://datasheet.ciiva.com/30137/aoa0000ce2-30137813.pdf?src-supplier=Onlinecomponents.com; ComponentLink4URL: https://datasheet.ciiva.com/46436/1678782-46436790.pdf?src-supplier=Element14; ComponentLink4Description: https://datasheet.ciiva.com/46436/1678782-46436790.pdf?src-supplier=Element14; ComponentLink5URL: https://datasheet.ciiva.com/46436/1678782-46436791.pdf?src-supplier=Element14; ComponentLink5Description: https://datasheet.ciiva.com/46436/1678782-46436791.pdf?src-supplier=Element14; ComponentLink6URL: https://datasheet.ciiva.com/16782/70260748-16782408.pdf?src-supplier=Allied+Electronics; ComponentLink6Description: https://datasheet.ciiva.com/16782/70260748-16782408.pdf?src-supplier=Allied+Electronics; ComponentLink7URL: https://datasheet.ciiva.com/17207/aoa0000ce2-17207208.pdf?src-supplier=Avnet+Europe; ComponentLink7Description: https://datasheet.ciiva.com/17207/aoa0000ce2-17207208.pdf?src-supplier=Avnet+Europe; ComponentLink8URL: https://datasheet.ciiva.com/28568/1678782-28568699.pdf?src-supplier=Element14; ComponentLink8Description: https://datasheet.ciiva.com/28568/1678782-28568699.pdf?src-supplier=Element14; ComponentLink9URL: https://datasheet.ciiva.com/5915/aoa0000ce2-5915294.pdf?src-supplier=Farnell; ComponentLink9Description: https://datasheet.ciiva.com/5915/aoa0000ce2-5915294.pdf?src-supplier=Farnell; ComponentLink10URL: https://datasheet.ciiva.com/9184/aoa0000ce2-9184911.pdf?src-supplier=Avnet; ComponentLink10Description: https://datasheet.ciiva.com/9184/aoa0000ce2-9184911.pdf?src-supplier=Avnet; Parameter 1: *; JLCPCB Part #: C22827
R7 R118 = CMP-2100-03662-1: ±1% 100kΩ ±100ppm/℃ 0.1W 0603 Chip Resistor - Surface Mount ROHS; Manufacturer: Yageo; Manufacturer Part Number: RC0603FR-07100KL; Power Rating: 100mW; Voltage Rating: 50V; Resistance: 100KOhm; Temperature Coefficient: 100ppm/degreesC; Working Voltage: 75V; Datasheet Version: Rev. 5, 10/2016; Height: 0.45mm; Lead Free: LeadFree; Manufacturer URL: http://www.yageo.com/; Package Reference: 0603; Depth: 0.8mm; RoHSCompliant: true; Composition: ThickFilm; Military Standard: Not; Case/Package: 0603; Packaging: TapeandReel; Case Code (Imperial): 0603; Voltage Rating (DC): 50V; Case Code (Metric): 1608; Tolerance: 1%; Termination: SMD/SMT; Min Operating Temperature: -55degC; Number of Pins: 2; Length: 1.6mm; Width: 0.8mm; Datasheet URL: http://www.yageo.com/NewPortal/yageodocoutput?fileName=/pdf/R-Chip/PYu-RC_Group_51_RoHS_L_5.pdf; Package Description: 2-Pin Surface Mount Device, Body 1.6 x 0.8 mm; Max Operating Temperature: 155degC; REACH SVHC: NoSVHC; Supplier 1: Digi-Key; Supplier Part Number 1: 311-100KHRCT-ND; RoHS: Yes; Category: Chip SMD Resistors; Stock 1: 19283456; Pricing 1: 1=0.10000, 10=0.02400, 100=0.00970, 1000=0.00436, 2500=0.00378 (USD); Series: RC; Max Power Dissipation: 100mW; Resistor Type: Thick Film; Number of Terminations: 2; Resistance Tolerance: 1%; Features: Moisture Resistant; Construction: Rectangular; Technology: THICK FILM; RoHS Compliant: Yes; ComponentLink1URL: https://datasheet.ciiva.com/11808/0900766b80f96399-11808107.pdf?src-supplier=RSComponents; ComponentLink1Description: https://datasheet.ciiva.com/11808/0900766b80f96399-11808107.pdf?src-supplier=RSComponents; ComponentLink2URL: https://datasheet.ciiva.com/7983/443971-7983593.pdf?src-supplier=Element14; ComponentLink2Description: https://datasheet.ciiva.com/7983/443971-7983593.pdf?src-supplier=Element14; ComponentLink3URL: https://datasheet.ciiva.com/46440/1868787-46440889.pdf?src-supplier=Element14; ComponentLink3Description: https://datasheet.ciiva.com/46440/1868787-46440889.pdf?src-supplier=Element14; ComponentLink4URL: https://datasheet.ciiva.com/7746/1738695-7746234.pdf?src-supplier=Element14; ComponentLink4Description: https://datasheet.ciiva.com/7746/1738695-7746234.pdf?src-supplier=Element14; ComponentLink5URL: https://datasheet.ciiva.com/7746/1738695-7746235.pdf?src-supplier=Element14; ComponentLink5Description: https://datasheet.ciiva.com/7746/1738695-7746235.pdf?src-supplier=Element14; ComponentLink6URL: https://datasheet.ciiva.com/22747/443971-22747516.pdf?src-supplier=Element14; ComponentLink6Description: https://datasheet.ciiva.com/22747/443971-22747516.pdf?src-supplier=Element14; Parameter 1: *; JLCPCB Part #: C25803
R9 = CMP-1659-00044-1: 150kΩ ±1% ±100ppm/℃ 0.1W 0603 Chip Resistor - Surface Mount ROHS; Manufacturer: Yageo; Manufacturer Part Number: RC0603FR-07150KL; Resistance: 150kR; Power Rating: 100mW; Voltage Rating: 50V; Temperature Coefficient: 100ppm/°C; ComponentLink1Description: Manufacturer URL; DatasheetVersion: Rev. 4, 02/2016; ComponentLink2URL: http://www.yageo.com/documents/recent/PYu-RC_Group_51_RoHS_L_04.pdf; ComponentLink2Description: Datasheet; PackageReference: 0603; ComponentLink1URL: http://www.yageo.com/; PackageDescription: 2-Pin Surface Mount Device, Body 1.6 x 0.8 mm; Supplier 1: Digi-Key; Supplier Part Number 1: 311-150KHRCT-ND; RoHS: Yes; Category: Chip SMD Resistors; Stock 1: 824633; Pricing 1: 1=0.10000, 10=0.02400, 100=0.00970, 1000=0.00436, 2500=0.00378 (USD); Case/Package: 0603; Number of Pins: 2; Case Code (Metric): 1608; Case Code (Imperial): 0603; Size Code: 0603; Min Operating Temperature: -55°C; Max Operating Temperature: 155°C; Packaging: Tape and Reel; Termination: SMD/SMT; Package Quantity: 1; Resistor Type: Thick Film; Max Power Dissipation: 100mW; Series: RC; Tolerance: 1%; Voltage Rating (DC): 50V; Number of Terminations: 2; Resistance Tolerance: 1%; Features: Moisture Resistant; Construction: Rectangular; Length: 0.063inch; Width: 0.031inch; Height: 0.022inch; Depth: 0.8mm; RoHS Compliant: Yes; Military Standard: Not; Lead Free: Lead Free; REACH SVHC: No SVHC; ComponentLink3URL: https://datasheet.ciiva.com/2454/pyu-r-int-thick-7-2454080.pdf?src-supplier=Digi-Key; ComponentLink3Description: https://datasheet.ciiva.com/2454/pyu-r-int-thick-7-2454080.pdf?src-supplier=Digi-Key; ComponentLink4URL: https://datasheet.ciiva.com/15189/getdatasheetpartid-326478-15189611.pdf?src-supplier=Verical; ComponentLink4Description: https://datasheet.ciiva.com/15189/getdatasheetpartid-326478-15189611.pdf?src-supplier=Verical; ComponentLink5URL: https://datasheet.ciiva.com/46412/443971-46412843.pdf?src-supplier=Element14; ComponentLink5Description: https://datasheet.ciiva.com/46412/443971-46412843.pdf?src-supplier=Element14; ComponentLink6URL: https://datasheet.ciiva.com/46440/1868787-46440892.pdf?src-supplier=Element14; ComponentLink6Description: https://datasheet.ciiva.com/46440/1868787-46440892.pdf?src-supplier=Element14; ComponentLink7URL: https://datasheet.ciiva.com/2454/pyu-r-int-thick-7-2454078.pdf?src-supplier=Digi-Key; ComponentLink7Description: https://datasheet.ciiva.com/2454/pyu-r-int-thick-7-2454078.pdf?src-supplier=Digi-Key; ComponentLink8URL: https://datasheet.ciiva.com/7746/443971-7746254.pdf?src-supplier=Element14; ComponentLink8Description: https://datasheet.ciiva.com/7746/443971-7746254.pdf?src-supplier=Element14; ComponentLink9URL: https://datasheet.ciiva.com/2454/pyu-r-int-thick-7-2454079.pdf?src-supplier=Digi-Key; ComponentLink9Description: https://datasheet.ciiva.com/2454/pyu-r-int-thick-7-2454079.pdf?src-supplier=Digi-Key; ComponentLink10URL: https://datasheet.ciiva.com/7746/443971-7746255.pdf?src-supplier=Element14; ComponentLink10Description: https://datasheet.ciiva.com/7746/443971-7746255.pdf?src-supplier=Element14; Parameter 1: *; JLCPCB Part #: C22807
R10 R60 R66 = RES: ±1% ±400ppm/℃ 5.1Ω 0.1W 0603 Chip Resistor - Surface Mount ROHS; Part Number: ERJ3EKF1803V; Manufacturer: Panasonic; Manufacturer Part Number: ERJ-3EKF1803V; Resistance: 180kR; Power Rating: 100mW; Voltage Rating: 75V; Temperature Coefficient: 100ppm/°C; Supplier 1: Digi-Key; Supplier Part Number 1: P180KHCT-ND; RoHS: Yes; Category: Chip SMD Resistors; Stock 1: 113875; Pricing 1: 1=0.10000, 10=0.06100, 100=0.02460, 1000=0.01106, 2500=0.00960 (USD); Mount: Surface Mount; Case/Package: 0603; Case Code (Metric): 1608; Case Code (Imperial): 0603; Contact Plating: Tin; Weight: 7.1E-05oz; Min Operating Temperature: -55°C; Max Operating Temperature: 155°C; Tolerance: 1%; Packaging: Tape and Reel; Resistor Type: Thick Film; Series: ERJ; Package Quantity: 1; Number of Terminations: 2; Termination: SMD/SMT; Max Power Dissipation: 100mW; Voltage Rating (DC): 75V; Construction: Rectangular; Features: Automotive AEC-Q200; Resistance Tolerance: 1%; Length: 1.6mm; Width: 0.031inch; Height: 0.022inch; Depth: 0.8mm; Radiation Hardening: No; RoHS Compliant: Yes; Military Standard: Not; Lead Free: Lead Free; REACH SVHC: No SVHC; ComponentLink1URL: https://datasheet.ciiva.com/22739/426256-22739797.pdf?src-supplier=Element14; ComponentLink1Description: https://datasheet.ciiva.com/22739/426256-22739797.pdf?src-supplier=Element14; ComponentLink2URL: https://datasheet.ciiva.com/24162/aoa0000ce2-24162661.pdf?src-supplier=Mouser; ComponentLink2Description: https://datasheet.ciiva.com/24162/aoa0000ce2-24162661.pdf?src-supplier=Mouser; ComponentLink3URL: https://datasheet.ciiva.com/30137/aoa0000ce2-30137813.pdf?src-supplier=Onlinecomponents.com; ComponentLink3Description: https://datasheet.ciiva.com/30137/aoa0000ce2-30137813.pdf?src-supplier=Onlinecomponents.com; ComponentLink4URL: https://datasheet.ciiva.com/46436/1678782-46436790.pdf?src-supplier=Element14; ComponentLink4Description: https://datasheet.ciiva.com/46436/1678782-46436790.pdf?src-supplier=Element14; ComponentLink5URL: https://datasheet.ciiva.com/46436/1678782-46436791.pdf?src-supplier=Element14; ComponentLink5Description: https://datasheet.ciiva.com/46436/1678782-46436791.pdf?src-supplier=Element14; ComponentLink6URL: https://datasheet.ciiva.com/16782/70260748-16782408.pdf?src-supplier=Allied+Electronics; ComponentLink6Description: https://datasheet.ciiva.com/16782/70260748-16782408.pdf?src-supplier=Allied+Electronics; ComponentLink7URL: https://datasheet.ciiva.com/17207/aoa0000ce2-17207208.pdf?src-supplier=Avnet+Europe; ComponentLink7Description: https://datasheet.ciiva.com/17207/aoa0000ce2-17207208.pdf?src-supplier=Avnet+Europe; ComponentLink8URL: https://datasheet.ciiva.com/28568/1678782-28568699.pdf?src-supplier=Element14; ComponentLink8Description: https://datasheet.ciiva.com/28568/1678782-28568699.pdf?src-supplier=Element14; ComponentLink9URL: https://datasheet.ciiva.com/5915/aoa0000ce2-5915294.pdf?src-supplier=Farnell; ComponentLink9Description: https://datasheet.ciiva.com/5915/aoa0000ce2-5915294.pdf?src-supplier=Farnell; ComponentLink10URL: https://datasheet.ciiva.com/9184/aoa0000ce2-9184911.pdf?src-supplier=Avnet; ComponentLink10Description: https://datasheet.ciiva.com/9184/aoa0000ce2-9184911.pdf?src-supplier=Avnet; Parameter 1: *; JLCPCB Part #: C25197
R19 = CMP-2000-04829-1: 1MΩ ±1% ±100ppm/℃ 0.1W 0603 Chip Resistor - Surface Mount ROHS; Manufacturer: Yageo; Part Number: AC0603FR-071ML; Resistance: 1MR; Power Rating: 100mW; Temperature Coefficient: 100ppm/°C; Voltage Rating: 50V; Supplier 1: Digi-Key; Supplier Part Number 1: 311-1MLDCT-ND; Manufacturer Part Number: AC0603FR-071ML; RoHS: Yes; Category: Chip SMD Resistors; Stock 1: 1569; Pricing 1: 1=0.10000, 10=0.02900, 100=0.01170, 1000=0.00527, 2500=0.00458 (USD); Case/Package: 0603; Case Code (Metric): 1608; Case Code (Imperial): 0603; Min Operating Temperature: -55°C; Max Operating Temperature: 155°C; Tolerance: 1%; Packaging: Tape and Reel; Resistor Type: Thick Film; Number of Terminations: 2; Max Power Dissipation: 100mW; Series: AC; Package Quantity: 1; Termination: SMD/SMT; Features: Moisture Resistant,Automotive AEC-Q200,Anti-Sulfur; Length: 0.063inch; Width: 0.031inch; Height: 0.022inch; RoHS Compliant: Yes; Lead Free: Lead Free; ComponentLink1URL: https://datasheet.ciiva.com/5562/pyu-ac-51-rohs-l-2-5562551.pdf?src-supplier=Mouser; ComponentLink1Description: https://datasheet.ciiva.com/5562/pyu-ac-51-rohs-l-2-5562551.pdf?src-supplier=Mouser; Parameter 1: *; JLCPCB Part #: C22935
R20 = CMP-2100-03662-1: ±1% 51kΩ ±100ppm/℃ 0.1W 0603 Chip Resistor - Surface Mount ROHS; Manufacturer: Yageo; Manufacturer Part Number: RC0603FR-07100KL; Power Rating: 100mW; Voltage Rating: 50V; Resistance: 100KOhm; Temperature Coefficient: 100ppm/degreesC; Working Voltage: 75V; Datasheet Version: Rev. 5, 10/2016; Height: 0.45mm; Lead Free: LeadFree; Manufacturer URL: http://www.yageo.com/; Package Reference: 0603; Depth: 0.8mm; RoHSCompliant: true; Composition: ThickFilm; Military Standard: Not; Case/Package: 0603; Packaging: TapeandReel; Case Code (Imperial): 0603; Voltage Rating (DC): 50V; Case Code (Metric): 1608; Tolerance: 1%; Termination: SMD/SMT; Min Operating Temperature: -55degC; Number of Pins: 2; Length: 1.6mm; Width: 0.8mm; Datasheet URL: http://www.yageo.com/NewPortal/yageodocoutput?fileName=/pdf/R-Chip/PYu-RC_Group_51_RoHS_L_5.pdf; Package Description: 2-Pin Surface Mount Device, Body 1.6 x 0.8 mm; Max Operating Temperature: 155degC; REACH SVHC: NoSVHC; Supplier 1: Digi-Key; Supplier Part Number 1: 311-100KHRCT-ND; RoHS: Yes; Category: Chip SMD Resistors; Stock 1: 19737322; Pricing 1: 1=0.10000, 10=0.02400, 100=0.00970, 1000=0.00436, 2500=0.00378 (USD); Series: RC; Max Power Dissipation: 100mW; Resistor Type: Thick Film; Number of Terminations: 2; Resistance Tolerance: 1%; Features: Moisture Resistant; Construction: Rectangular; Technology: THICK FILM; RoHS Compliant: Yes; ComponentLink1URL: https://datasheet.ciiva.com/11808/0900766b80f96399-11808107.pdf?src-supplier=RSComponents; ComponentLink1Description: https://datasheet.ciiva.com/11808/0900766b80f96399-11808107.pdf?src-supplier=RSComponents; ComponentLink2URL: https://datasheet.ciiva.com/7983/443971-7983593.pdf?src-supplier=Element14; ComponentLink2Description: https://datasheet.ciiva.com/7983/443971-7983593.pdf?src-supplier=Element14; ComponentLink3URL: https://datasheet.ciiva.com/46440/1868787-46440889.pdf?src-supplier=Element14; ComponentLink3Description: https://datasheet.ciiva.com/46440/1868787-46440889.pdf?src-supplier=Element14; ComponentLink4URL: https://datasheet.ciiva.com/7746/1738695-7746234.pdf?src-supplier=Element14; ComponentLink4Description: https://datasheet.ciiva.com/7746/1738695-7746234.pdf?src-supplier=Element14; ComponentLink5URL: https://datasheet.ciiva.com/7746/1738695-7746235.pdf?src-supplier=Element14; ComponentLink5Description: https://datasheet.ciiva.com/7746/1738695-7746235.pdf?src-supplier=Element14; ComponentLink6URL: https://datasheet.ciiva.com/22747/443971-22747516.pdf?src-supplier=Element14; ComponentLink6Description: https://datasheet.ciiva.com/22747/443971-22747516.pdf?src-supplier=Element14; Parameter 1: *; JLCPCB Part #: C23196